# Altium project Light_Clock.PrjPcb
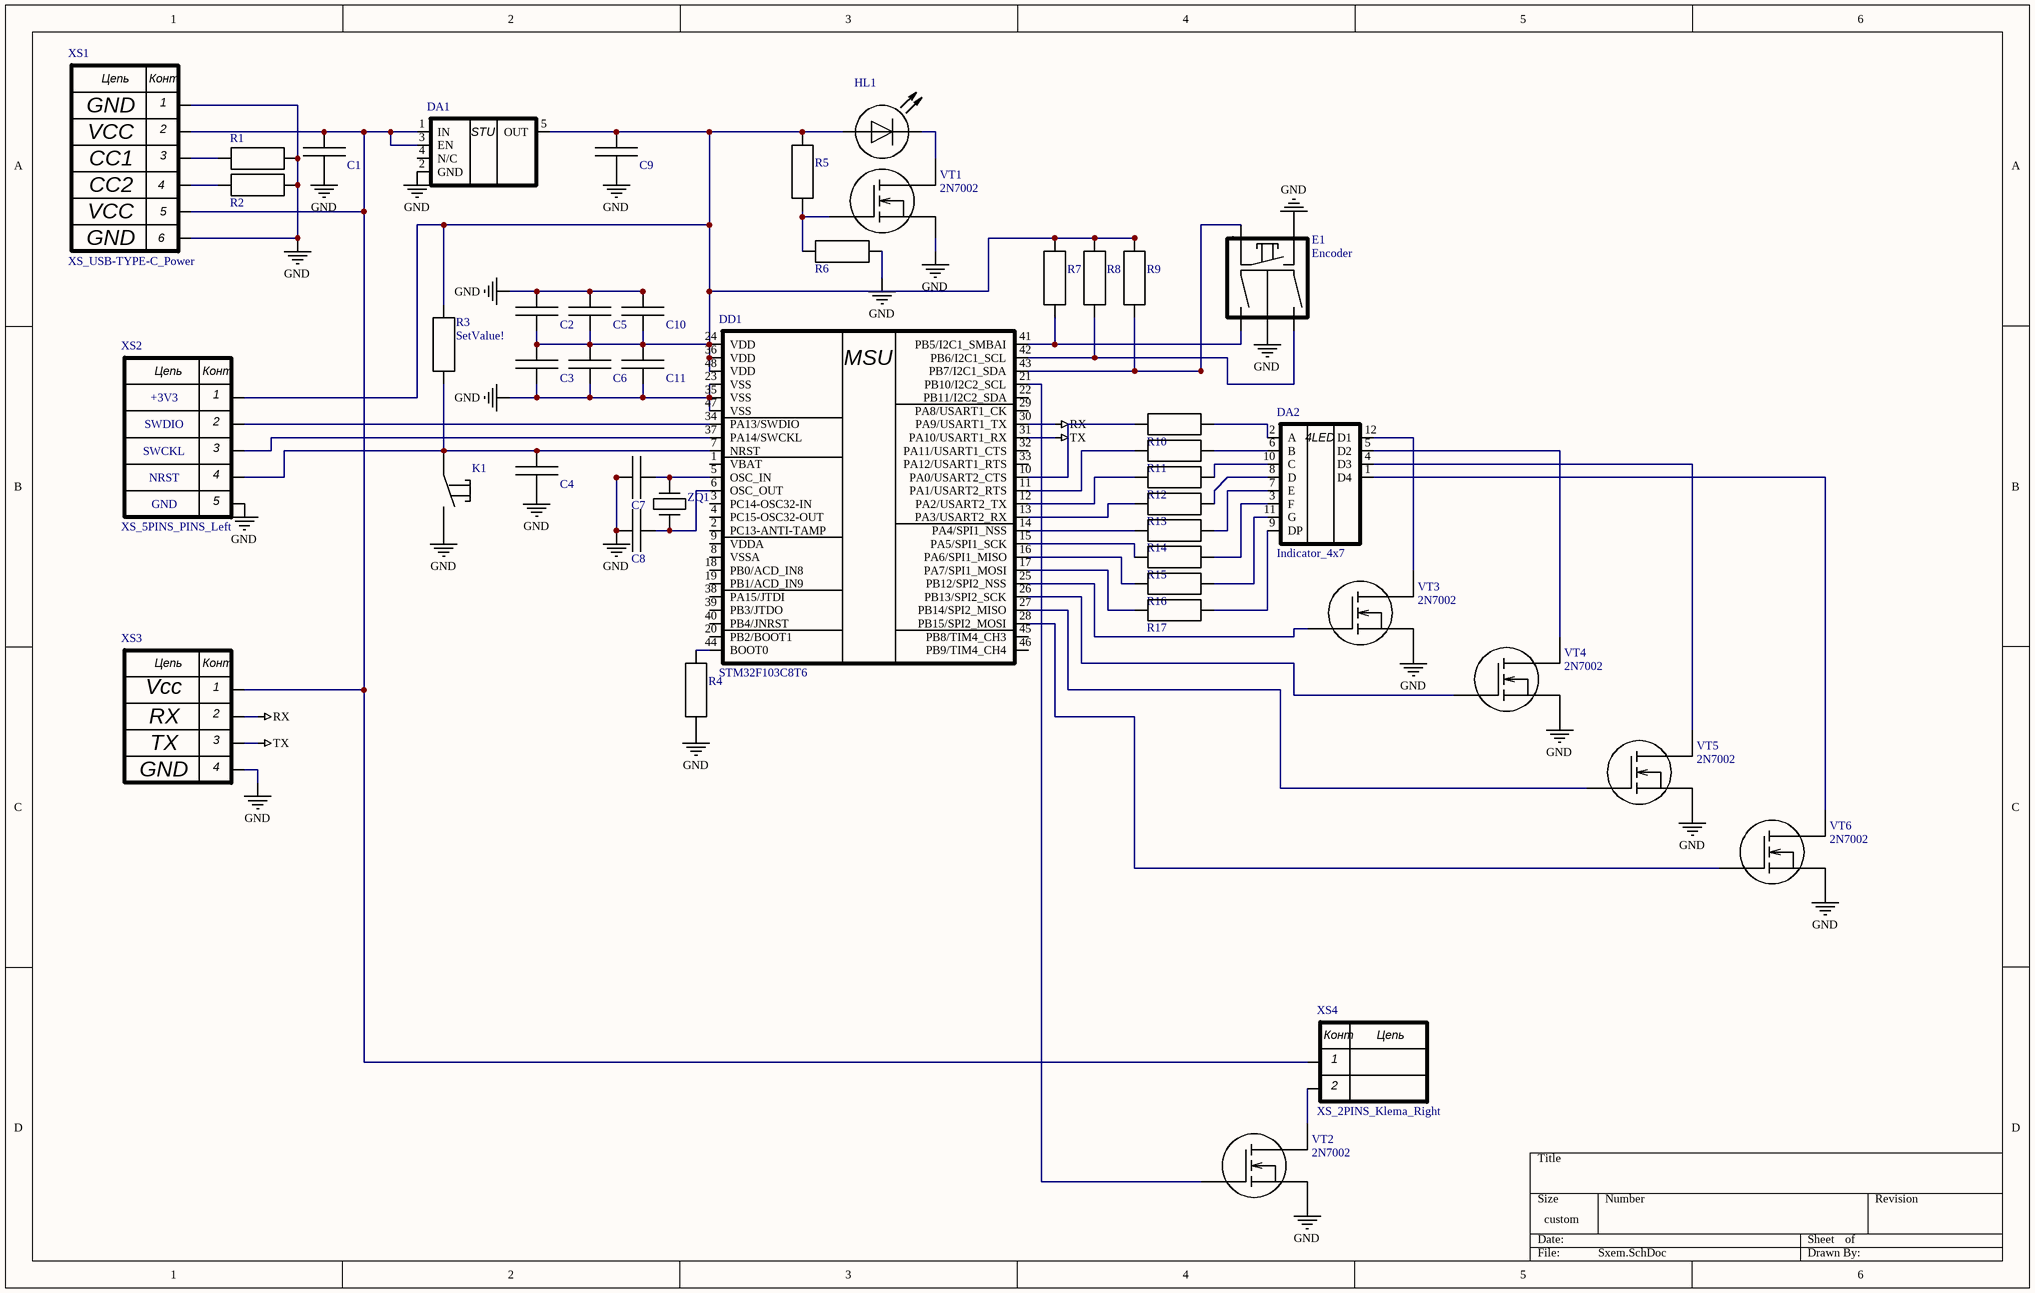
[diagram p0: Sxem.SchDoc]
1 sheet, 45 parts. Net scope: global (net labels, ports and power ports of the same name join across sheets).
Board files: Plata.PcbDoc, Copy of AllPlats.PcbDoc

## Sheet Sxem.SchDoc
size 381 x 241 mm; SheetNumber: 1; SheetTotal: 1

### Parts
C1  SetValue!  [C_SMD_0603]  (value not drawn)
C2  SetValue!  [C_SMD_0603]  (value not drawn)
C3  SetValue!  [C_SMD_0603]  (value not drawn)
C4  SetValue!  [C_SMD_0603]  (value not drawn)
C5  SetValue!  [C_SMD_0603]  (value not drawn)
C6  SetValue!  [C_SMD_0603]  (value not drawn)
C7  SetValue!  [C_SMD_0603]  (value not drawn)
C8  SetValue!  [C_SMD_0603]  (value not drawn)
C9  SetValue!  [C_SMD_0603]  (value not drawn)
C10  SetValue!  [C_SMD_0603]  (value not drawn)
C11  SetValue!  [C_SMD_0603]  (value not drawn)
DA1  STU_5.5-3.3_NCP114ASN330T1G_SMD_TSOP-5  [TSOP-5]  (value not drawn)
DA2  Indicator_4x7  [4x7 Inditacor]
DD1  STM32F103C8T6  [LQFP48]
E1  Encoder  [ENCODER]
HL1  LED_SMD_RED  [LED_SMD_RED]  (value not drawn)
K1  BUT_SMD_KLS7-TS3608-5.0-180  [BUT_SMD_KLS7-TS3608-5.0-180]  (value not drawn)
R1  SetValue!  [R_SMD_0805]  (value not drawn)
R2  SetValue!  [R_SMD_0805]  (value not drawn)
R3  SetValue!  [R_SMD_0805]
R4  SetValue!  [R_SMD_0805]  (value not drawn)
R5  SetValue!  [R_SMD_0805]  (value not drawn)
R6  SetValue!  [R_SMD_0805]  (value not drawn)
R7  SetValue!  [R_SMD_0805]  (value not drawn)
R8  SetValue!  [R_SMD_0805]  (value not drawn)
R9  SetValue!  [R_SMD_0805]  (value not drawn)
R10  SetValue!  [R_SMD_0805]  (value not drawn)
R11  SetValue!  [R_SMD_0805]  (value not drawn)
R12  SetValue!  [R_SMD_0805]  (value not drawn)
R13  SetValue!  [R_SMD_0805]  (value not drawn)
R14  SetValue!  [R_SMD_0805]  (value not drawn)
R15  SetValue!  [R_SMD_0805]  (value not drawn)
R16  SetValue!  [R_SMD_0805]  (value not drawn)
R17  SetValue!  [R_SMD_0805]  (value not drawn)
VT1  2N7002  [SOT23-3]
VT2  2N7002  [SOT23-3]
VT3  2N7002  [SOT23-3]
VT4  2N7002  [SOT23-3]
VT5  2N7002  [SOT23-3]
VT6  2N7002  [SOT23-3]
XS1  XS_USB-TYPE-C_Power  [USB-TYPE-C_6P]
XS2  XS_5PINS_PINS_Left  [5PINS]
XS3  XS_4PINS_PINS_Left  [4PINS]  (value not drawn)
XS4  XS_2PINS_Klema_Right  [XS_2PINS]
ZQ1  Quartz_8MGz_THT_HC-49S  [Quartz]  (value not drawn)

### Nets
GND: C1.1 C2.2 C3.1 C4.1 C5.2 C6.1 C7.2 C8.2 C9.1 C10.2 C11.1 DA1.2(GND) DD1.23(VSS) DD1.35(VSS) DD1.47(VSS) E1.2(F) E1.5(GND) K1.2 R1.2 R2.2 R4.1 R6.2 VT1.2(И) VT2.2(И) VT3.2(И) VT4.2(И) VT5.2(И) VT6.2(И) XS1.1 XS1.6 XS2.5 XS3.4
RX: DD1.30(PA9/USART1_TX) XS3.2
TX: DD1.31(PA10/USART1_RX) XS3.3
NetC1_2: C1.2 DA1.1(IN) DA1.3(EN) XS1.2 XS1.5 XS3.1 XS4.1
NetC2_1: C2.1 C3.2 C5.1 C6.2 C9.2 C10.1 C11.2 DA1.5(OUT) DD1.24(VDD) DD1.36(VDD) DD1.48(VDD) HL1.1 R3.2 R5.2 R7.2 R8.2 R9.2 XS2.1
NetC4_2: C4.2 DD1.7(NRST) K1.1 R3.1 XS2.4
NetC7_1: C7.1 DD1.5(OSC_IN) ZQ1.2
NetC8_1: C8.1 DD1.6(OSC_OUT) ZQ1.1
NetDA2_1: DA2.1(D4) VT6.3(C)
NetDA2_2: DA2.2(A) R10.1
NetDA2_3: DA2.3(F) R15.1
NetDA2_4: DA2.4(D3) VT5.3(C)
NetDA2_5: DA2.5(D2) VT4.3(C)
NetDA2_6: DA2.6(B) R11.1
NetDA2_7: DA2.7(E) R14.1
NetDA2_8: DA2.8(D) R13.1
NetDA2_9: DA2.9(DP) R17.1
NetDA2_10: DA2.10(C) R12.1
NetDA2_11: DA2.11(G) R16.1
NetDA2_12: DA2.12(D1) VT3.3(C)
NetDD1_10: DD1.10(PA0/USART2_CTS) R10.2
NetDD1_11: DD1.11(PA1/USART2_RTS) R11.2
NetDD1_12: DD1.12(PA2/USART2_TX) R12.2
NetDD1_13: DD1.13(PA3/USART2_RX) R13.2
NetDD1_14: DD1.14(PA4/SPI1_NSS) R14.2
NetDD1_15: DD1.15(PA5/SPI1_SCK) R15.2
NetDD1_16: DD1.16(PA6/SPI1_MISO) R16.2
NetDD1_17: DD1.17(PA7/SPI1_MOSI) R17.2
NetDD1_21: DD1.21(PB10/I2C2_SCL) VT2.1(З)
NetDD1_25: DD1.25(PB12/SPI2_NSS) VT3.1(З)
NetDD1_26: DD1.26(PB13/SPI2_SCK) VT4.1(З)
NetDD1_27: DD1.27(PB14/SPI2_MISO) VT5.1(З)
NetDD1_28: DD1.28(PB15/SPI2_MOSI) VT6.1(З)
NetDD1_34: DD1.34(PA13/SWDIO) XS2.2
NetDD1_37: DD1.37(PA14/SWCKL) XS2.3
NetDD1_41: DD1.41(PB5/I2C1_SMBAI) E1.3(A) R7.1
NetDD1_42: DD1.42(PB6/I2C1_SCL) E1.4(B) R8.1
NetDD1_43: DD1.43(PB7/I2C1_SDA) E1.1(E) R9.1
NetDD1_44: DD1.44(BOOT0) R4.2
NetHL1_2: HL1.2 VT1.3(C)
NetR1_1: R1.1 XS1.3
NetR2_1: R2.1 XS1.4
NetR5_1: R5.1 R6.1 VT1.1(З)
NetVT2_3: VT2.3(C) XS4.2

Not connected (* = marked no-connect by the designer): DA1 4(N/C); DD1 1(VBAT) 2(PC13-ANTI-TAMP) 3(PC14-OSC32-IN) 4(PC15-OSC32-OUT) 8(VSSA) 9(VDDA) 18(PB0/ACD_IN8) 19(PB1/ACD_IN9) 20(PB2/BOOT1) 22(PB11/I2C2_SDA) 29(PA8/USART1_CK) 32(PA11/USART1_CTS) 33(PA12/USART1_RTS) 38(PA15/JTDI) 39(PB3/JTDO) 40(PB4/JNRST) 45(PB8/TIM4_CH3) 46(PB9/TIM4_CH4)

### Notes on the sheet
- +3V3
- (near XS2) SWDIO
- GND
- (near XS2) SWCKL
- NRST
- (near XS3) Vcc
- (near XS3) GND
- RX
- TX
- (in symbol Indicator_4x7) 4LED
- (in symbol STM32_F103c8t6_LQFP48) MSU
- (in symbol STU_5.5-3.3_NCP114ASN330T1G_SMD_TSOP-5) STU
- (in symbol XS_2PINS_Klema_Right) Конт; Цепь
- (in symbol XS_4PINS_PINS_Left) Цепь; Конт
- (in symbol XS_5PINS_PINS_Left) Цепь; Конт
- (in symbol XS_USB-TYPE-C_Power) Цепь; Конт; GND; VCC; CC1; CC2

### Library data of the parts
C1-C11 = C_Ceramic_SMD_0603
DD1 = STM32_F103c8t6_LQFP48
R1-R17 = R_SMD_0805
VT1-VT6 = T_PI_N_2N7002_SMD_SOT-23-3_1